# Altium project Tecotec_GYT_Tx.PrjPcb
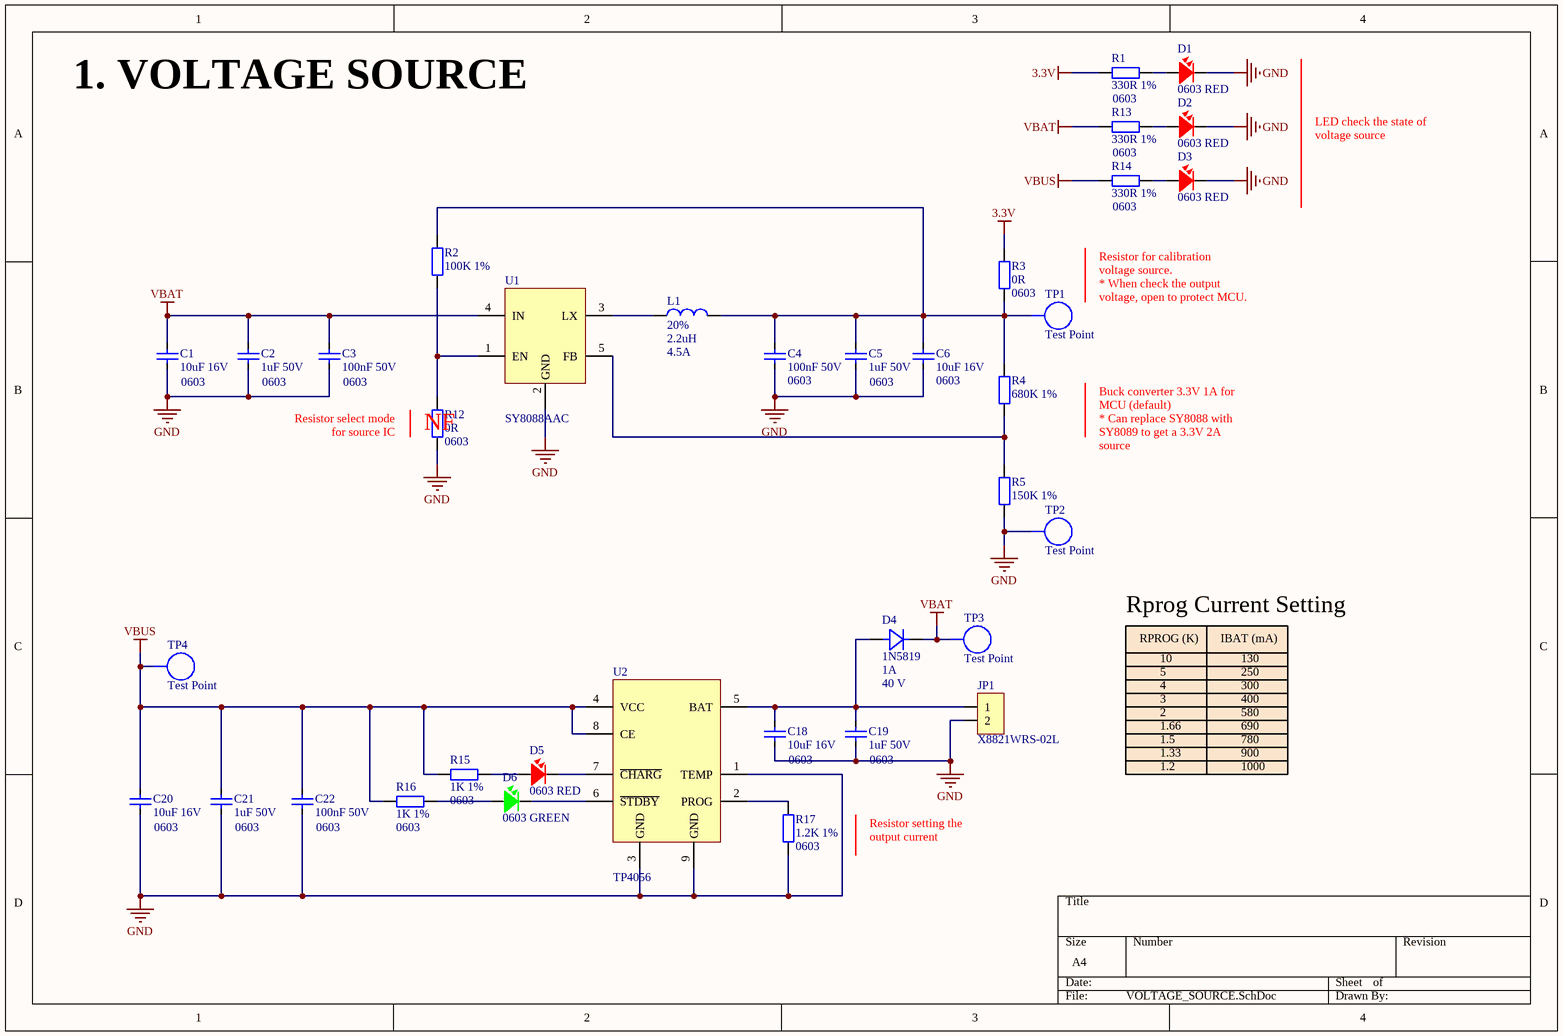
[diagram p0: VOLTAGE_SOURCE.SchDoc]
4 sheets, 103 parts. Net scope: global (net labels, ports and power ports of the same name join across sheets).
Board file: PCB.PcbDoc
Sheets:
  VOLTAGE_SOURCE.SchDoc
  DISPLAY.SchDoc
  MCU.SchDoc
  FUNCTION_BUTTONS.SchDoc

## Sheet VOLTAGE_SOURCE.SchDoc: Tecotec GYT Tx
size A4; DrawnBy: Nhatkhongbuon; SheetNumber: 1; SheetTotal: 4

### Parts
C1  10uF 16V  Size: 0603  [CAP_SMD_0603]
C2  1uF 50V  Size: 0603  [CAP_SMD_0603]
C3  100nF 50V  Size: 0603  [CAP_SMD_0603]
C4  100nF 50V  Size: 0603  [CAP_SMD_0603]
C5  1uF 50V  Size: 0603  [CAP_SMD_0603]
C6  10uF 16V  Size: 0603  [CAP_SMD_0603]
C18  10uF 16V  Size: 0603  [CAP_SMD_0603]
C19  1uF 50V  Size: 0603  [CAP_SMD_0603]
C20  10uF 16V  Size: 0603  [CAP_SMD_0603]
C21  1uF 50V  Size: 0603  [CAP_SMD_0603]
C22  100nF 50V  Size: 0603  [CAP_SMD_0603]
D1  0603 RED  [LED-0603]
D2  0603 RED  [LED-0603]
D3  0603 RED  [LED-0603]
D4  1N5819  Current - Average Rectified (Io): 1A  Voltage - DC Reverse (Vr) (Max): 40 V  [DIO-SMD-123]
D5  0603 RED  [LED-0603]
D6  0603 GREEN  [LED-0603]
JP1  X8821WRS-02L  [CONN_X8821WRS-02L-LPSN]
L1  Tolerance: 20%  Inductor: 2.2uH  Current: 4.5A  [L0420]  (hidden comment: 2.2uH 4.5A 20%)
R1  330R 1%  Size: 0603  [RES_SMD_0603]
R2  100K 1%  [RES_SMD_0603]
R3  0R  Size: 0603  [RES_SMD_0603]
R4  680K 1%  [RES_SMD_0603]
R5  150K 1%  [RES_SMD_0603]
R12  0R  Size: 0603  [RES_SMD_0603]
R13  330R 1%  Size: 0603  [RES_SMD_0603]
R14  330R 1%  Size: 0603  [RES_SMD_0603]
R15  1K 1%  Size: 0603  [RES_SMD_0603]
R16  1K 1%  Size: 0603  [RES_SMD_0603]
R17  1.2K 1%  Size: 0603  [RES_SMD_0603]
TP1  Test Point  [TEST_POINT]
TP2  Test Point  [TEST_POINT]
TP3  Test Point  [TEST_POINT]
TP4  Test Point  [TEST_POINT]
U1  SY8088AAC  [SOT23_5]
U2  TP4056  [ESOP-8]

### Nets
3.3V: R1.1 R3.2
GND: C1.1 C2.1 C3.1 C4.1 C5.1 C6.1 C18.1 C19.1 C20.1 C21.1 C22.1 D1.2 D2.2 D3.2 JP1.2 R5.1 R12.1 R17.1 TP2.1 U1.2(GND) U2.1(TEMP) U2.3(GND) U2.9(GND)
VBAT: C1.2 C2.2 C3.2 D4.C R13.1 TP3.1 U1.4(IN)
VBUS: C20.2 C21.2 C22.2 R14.1 R15.2 R16.2 TP4.1 U2.4(VCC) U2.8(CE)
NetC4_2: C4.2 C5.2 C6.2 L1.2 R2.2 R3.1 R4.2 TP1.1
NetC18_2: C18.2 C19.2 D4.A JP1.1 U2.5(BAT)
NetD1_1: D1.1 R1.2
NetD2_1: D2.1 R13.2
NetD3_1: D3.1 R14.2
NetD5_1: D5.1 R15.1
NetD5_2: D5.2 U2.7(~{CHARG})
NetD6_1: D6.1 R16.1
NetD6_2: D6.2 U2.6(~{STDBY})
NetL1_1: L1.1 U1.3(LX)
NetR2_1: R2.1 R12.2 U1.1(EN)
NetR4_1: R4.1 R5.2 U1.5(FB)
NetR17_2: R17.2 U2.2(PROG)

### Notes on the sheet
- 1. VOLTAGE SOURCE
- LED check the state of voltage source
- Resistor for calibration voltage source.
  * When check the output voltage, open to protect MCU.
- Resistor select mode for source IC
- (near R12) NF
- Buck converter 3.3V 1A for MCU (default)
  * Can replace SY8088 with SY8089 to get a 3.3V 2A source
- Rprog Current Setting
- RPROG (K)
- IBAT (mA)
- 10
- 2
- 3
- 4
- 5
- 130
- 250
- 300
- 400
- 580
- 1.66
- 1.5
- 1.33
- 1.2
- 690
- 780
- 900
- 1000
- Resistor setting the output current

### Library data of the parts
C1 C6 C18 C20 = C0603_MLCC_10uF_16V: 10 µF ±20% 16V Ceramic Capacitor X6S 0603 (1608 Metric); Manufacturer: Murata Electronics; Manufacture Part Number: GRM188C81C106MA73D; Packaging: Cut Tape (CT); Link: https://www.digikey.cn/en/products/detail/murata-electronics/GRM188C81C106MA73D/3900463; Price: $0.25
C2 C5 C19 C21 = C0603_MLCC_1uF_50V: 1 µF ±10% 50V Ceramic Capacitor X5R 0603 (1608 Metric); Manufacturer: Samsung Electro-Mechanics; Manufacture Part Number: CL10A105KB8NNNC; Packaging: Cut Tape (CT); Link: https://www.digikey.cn/en/products/detail/samsung-electro-mechanics/CL10A105KB8NNNC/3887518; Price: $0.14
C3 C4 C22 = C0603_MLCC_100nF_50V: 0.1 µF ±10% 50V Ceramic Capacitor X7R 0603 (1608 Metric); Manufacturer: Samsung Electro-Mechanics; Manufacture Part Number: CL10B104KB8NNNC; Packaging: Cut Tape (CT); Link: https://www.digikey.cn/en/products/detail/samsung-electro-mechanics/CL10B104KB8NNNC/3886658; Price: $0.10
D1-D3 D5 = LED_0603_RED: Red 625nm LED Indication - Discrete 2V 0603 (1608 Metric); Manufacturer: Würth Elektronik; Manufacture Part Number: 150060RS75000; Packaging: Cut Tape (CT); Link: https://www.digikey.cn/en/products/detail/w%C3%BCrth-elektronik/150060RS75000/4489901; Price: $0.15
D4 = 1N5819: Diode 40 V 1A Surface Mount SOD-123; Manufacturer: Diodes Incorporated; Manufacture Part Number: 1N5819HW-7-F; Voltage - Forward (Vf) (Max) @ If: 450 mV @ 1 A; Capacitance @ Vr, F: 60pF @ 4V, 1MHz; Packaging: Cut Tape (CT); Link: https://www.digikey.cn/en/products/detail/diodes-incorporated/1N5819HW-7-F/814970; Price: $0.43; Operating Temperature - Junction: -65°C ~ 125°C
D6 = LED_0603_GREEN: Green 520nm LED Indication - Discrete 3.2V 0603 (1608 Metric); Manufacturer: Würth Elektronik; Manufacture Part Number: 150060GS75000; Packaging: Cut Tape (CT); Link: https://www.digikey.cn/en/products/detail/w%C3%BCrth-elektronik/150060GS75000/4489898; Price: $0.15
JP1 = X8821WRS-02L: 1x2P 2P 1 Tin 2.5mm 2 Brass 2A Surface Mount，Right Angle SMD,P=2.5mm,Surface Mount，Right Angle Wire To Board Connector ROHS; Manufacturer: XKB Connection; Manufacture Part Number: X8821WRS-02L-LPSN; Link: https://www.lcsc.com/product-detail/Wire-To-Board-Connector_XKB-Connection-X8821WRS-02L-LPSN_C519150.html; Price: $ 0.0852
L1 = L_0420_2.2uH_4.5A: 4.5A 2.2uH Molding Choke ±20% 5A SMD,0420 Power Inductors ROHS; Manufacturer: XR; Manufacture Part Number: XR0420-2R2M; Link: https://www.lcsc.com/product-detail/Power-Inductors_XR-XR0420-2R2M_C5307589.html; Price: $ 0.0661
R1 R13 R14 = R0603_330R: 330 Ohms ±1% 0.1W, 1/10W Chip Resistor 0603 (1608 Metric) Thick Film; Manufacturer: TE Connectivity Passive Product; Manufacture Part Number: CRG0603F330R; Packaging: Cut Tape (CT); Link: https://www.digikey.cn/en/products/detail/te-connectivity-passive-product/CRG0603F330R/2380765; Price: $0.10
R2 = R0603_100K: 100 kOhms ±1% 0.1W, 1/10W Chip Resistor 0603 (1608 Metric) Moisture Resistant Thick Film; Manufacturer: YAGEO; Manufacture Part Number: RC0603FR-07100KL; Packaging: Cut Tape (CT); Link: https://www.digikey.cn/en/products/detail/yageo/RC0603FR-07100KL/726889; Price: $0.10; Size: 0603
R3 R12 = R0603_0R: 0 Ohms Jumper Chip Resistor 0603 (1608 Metric) Automotive AEC-Q200 Thick Film; Manufacturer: Stackpole Electronics Inc; Manufacture Part Number: RMCF0603ZT0R00; Packaging: Cut Tape (CT); Link: https://www.digikey.cn/en/products/detail/stackpole-electronics-inc/RMCF0603ZT0R00/1756908; Price: $0.10
R4 = R0603_680K: 680 kOhms ±1% 0.1W, 1/10W Chip Resistor 0603 (1608 Metric) Moisture Resistant Thick Film; Manufacturer: YAGEO; Manufacture Part Number: RC0603FR-07680KL; Packaging: Cut Tape (CT); Link: https://www.digikey.cn/en/products/detail/yageo/RC0603FR-07680KL/727356; Price: $0.10; Size: 0603
R5 = R0603_150K: 150 kOhms ±1% 0.1W, 1/10W Chip Resistor 0603 (1608 Metric) Automotive AEC-Q200 Thick Film; Manufacturer: Vishay Dale; Manufacture Part Number: CRCW0603150KFKEA; Packaging: Cut Tape (CT); Link: https://www.digikey.cn/en/products/detail/vishay-dale/CRCW0603150KFKEA/1174914; Price: $0.10; Size: 0603
R15 R16 = R0603_1K: 1 kOhms ±1% 0.1W, 1/10W Chip Resistor 0603 (1608 Metric) Moisture Resistant Thick Film; Manufacturer: YAGEO; Manufacture Part Number: RC0603FR-071KL; Packaging: Cut Tape (CT); Link: https://www.digikey.cn/en/products/detail/yageo/RC0603FR-071KL/726843; Price: $0.10
R17 = R0603_1.2K: 1.2 kOhms ±1% 0.1W, 1/10W Chip Resistor 0603 (1608 Metric) Automotive AEC-Q200 Thick Film; Manufacturer: Stackpole Electronics Inc; Manufacture Part Number: RC0603FR-071KL; Packaging: Cut Tape (CT); Link: https://www.digikey.cn/en/products/detail/stackpole-electronics-inc/RMCF0603FT1K20/1761134; Price: $0.10
TP1-TP4 = TEST_POINT
U1 = SY8088AAC: Step-down type SOT-23-5 DC-DC Converters ROHS; Manufacturer: Silergy Corp; Manufacture Part Number: SY8088AAC; Link: https://www.lcsc.com/product-detail/DC-DC-Converters_Silergy-Corp-SY8088AAC_C79313.html; Price: $ 0.0865
U2 = TP4056: ESOP-8 Battery Management ICs ROHS; Manufacturer: UMW(Youtai Semiconductor Co., Ltd.); Manufacture Part Number: TP4056; Packaging: Cut Tape (CT); Link: https://www.lcsc.com/product-detail/Battery-Management-ICs_UMW-Youtai-Semiconductor-Co-Ltd-TP4056_C725790.html; Price: $ 0.0565

## Sheet DISPLAY.SchDoc
size A4; SheetNumber: 2; SheetTotal: 4
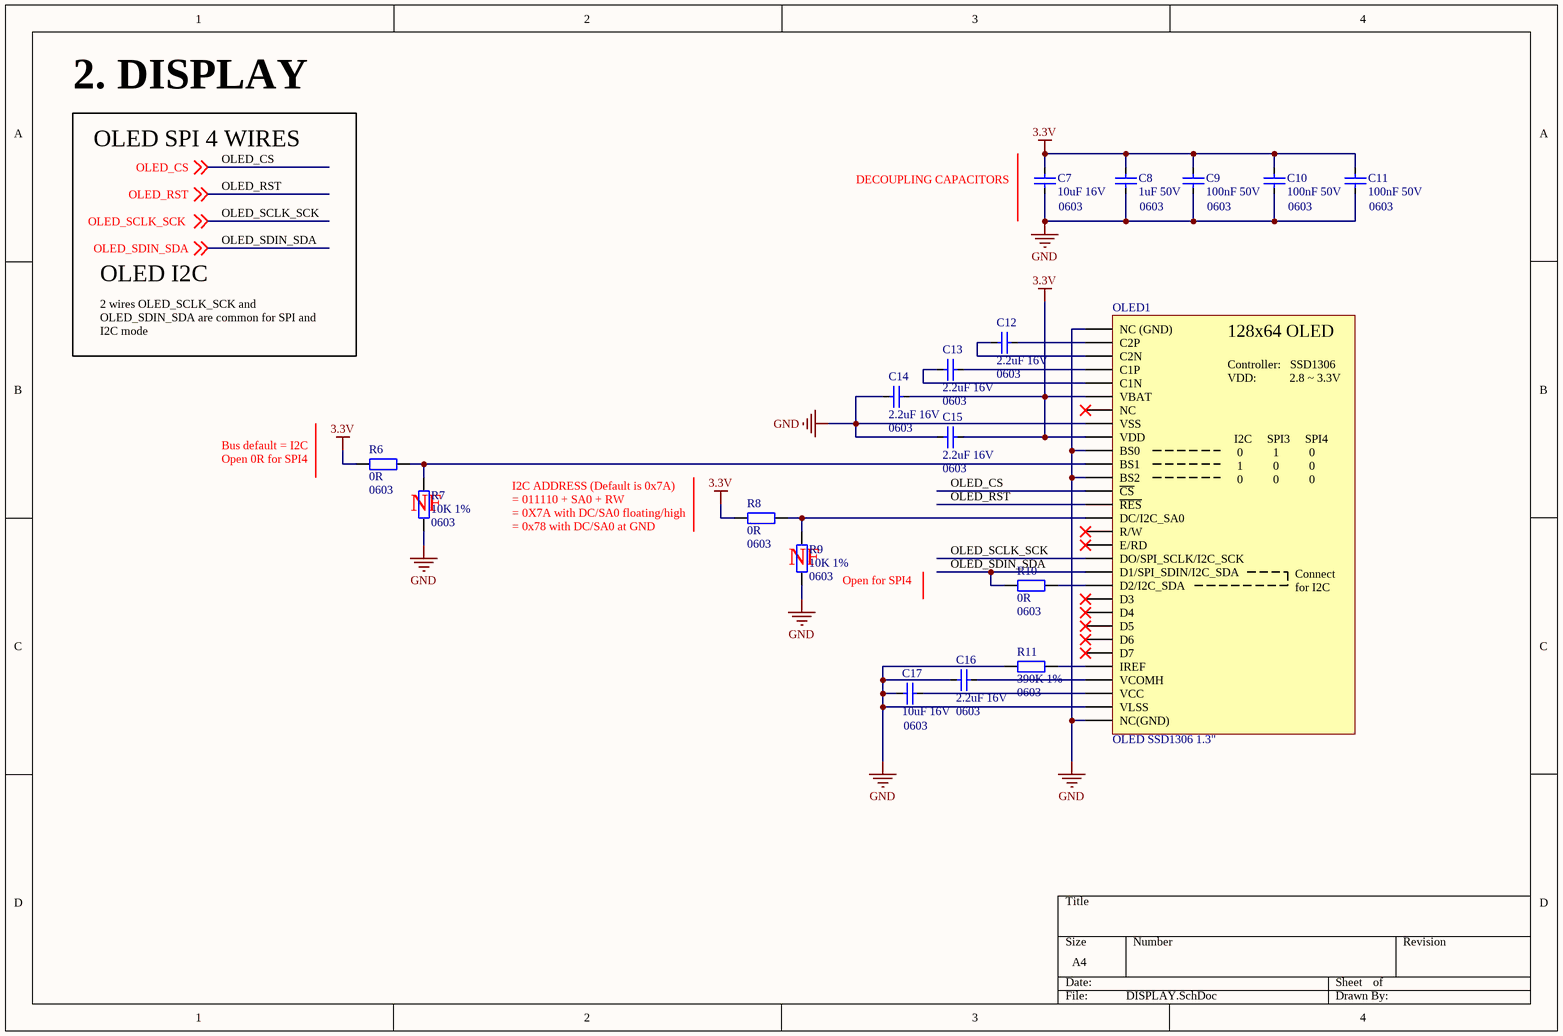
[diagram p1: DISPLAY.SchDoc]

### Parts
C7  10uF 16V  Size: 0603  [CAP_SMD_0603]
C8  1uF 50V  Size: 0603  [CAP_SMD_0603]
C9  100nF 50V  Size: 0603  [CAP_SMD_0603]
C10  100nF 50V  Size: 0603  [CAP_SMD_0603]
C11  100nF 50V  Size: 0603  [CAP_SMD_0603]
C12  2.2uF 16V  Size: 0603  [CAP_SMD_0603]
C13  2.2uF 16V  Size: 0603  [CAP_SMD_0603]
C14  2.2uF 16V  Size: 0603  [CAP_SMD_0603]
C15  2.2uF 16V  Size: 0603  [CAP_SMD_0603]
C16  2.2uF 16V  Size: 0603  [CAP_SMD_0603]
C17  10uF 16V  Size: 0603  [CAP_SMD_0603]
OLED1  OLED SSD1306 1.3"  [OLED 1.3]
R6  0R  Size: 0603  [RES_SMD_0603]
R7  10K 1%  Size: 0603  [RES_SMD_0603]
R8  0R  Size: 0603  [RES_SMD_0603]
R9  10K 1%  Size: 0603  [RES_SMD_0603]
R10  0R  Size: 0603  [RES_SMD_0603]
R11  390K 1%  Size: 0603  [RES_SMD_0603]

### Nets
3.3V: C7.2 C8.2 C9.2 C10.2 C11.2 C14.2 C15.2 OLED1.A6(VBAT) OLED1.A9(VDD) R6.1 R8.1
GND: C7.1 C8.1 C9.1 C10.1 C11.1 C14.1 C15.1 C16.2 C17.1 OLED1.A1(NC_(GND)) OLED1.A8(VSS) OLED1.A10(BS0) OLED1.A12(BS2) OLED1.A29(VLSS) OLED1.A30(NC(GND)) R7.1 R9.1 R11.1
OLED_CS: OLED1.A13(~{CS}) ; off-sheet OLED_CS
OLED_RST: OLED1.A14(~{RES}) ; off-sheet OLED_RST
OLED_SCLK_SCK: OLED1.A18(DO/SPI_SCLK/I2C_SCK) ; off-sheet OLED_SCLK_SCK   [also labelled OLED_SCLK_SCK ]
OLED_SDIN_SDA: OLED1.A19(D1/SPI_SDIN/I2C_SDA) R10.1 ; off-sheet OLED_SDIN_SDA  [also labelled OLED_SDIN_SDA ]
NetC12_1: C12.1 OLED1.A2(C2P)
NetC12_2: C12.2 OLED1.A3(C2N)
NetC13_1: C13.1 OLED1.A5(C1N)
NetC13_2: C13.2 OLED1.A4(C1P)
NetC16_1: C16.1 OLED1.A27(VCOMH)
NetC17_2: C17.2 OLED1.A28(VCC)
NetOLED1_A11: OLED1.A11(BS1) R6.2 R7.2
NetOLED1_A15: OLED1.A15(DC/I2C_SA0) R8.2 R9.2
NetOLED1_A20: OLED1.A20(D2/I2C_SDA) R10.2
NetOLED1_A26: OLED1.A26(IREF) R11.2

Not connected (* = marked no-connect by the designer): OLED1 A7(NC)* A16(R/W)* A17(E/RD)* A21(D3)* A22(D4)* A23(D5)* A24(D6)* A25(D7)*

### Notes on the sheet
- 2. DISPLAY
- OLED SPI 4 WIRES
- DECOUPLING CAPACITORS
- OLED I2C
- 2 wires OLED_SCLK_SCK and OLED_SDIN_SDA are common for SPI and I2C mode
- Bus default = I2C
  Open 0R for SPI4
- (near R7) NF
- (near R9) NF
- I2C ADDRESS (Default is 0x7A)
  = 011110 + SA0 + RW
  = 0X7A with DC/SA0 floating/high
  = 0x78 with DC/SA0 at GND
- (near R9) Open for SPI4
- (in symbol 1.3"_SSD1306_OLED) 128x64 OLED; Controller:   SSD1306 / VDD:           2.8 ~ 3.3V; I2C     SPI3     SPI4 / 0          1          0 / 1          0          0 / 0          0          0 /; Connect for I2C

### Library data of the parts
C7 C17 = C0603_MLCC_10uF_16V: as C1 on sheet VOLTAGE_SOURCE; Packaging: Cut Tape (CT); Link: https://www.digikey.cn/en/products/detail/murata-electronics/GRM188C81C106MA73D/3900463; Price: $0.25
C8 = C0603_MLCC_1uF_50V: as C2 on sheet VOLTAGE_SOURCE; Packaging: Cut Tape (CT); Link: https://www.digikey.cn/en/products/detail/samsung-electro-mechanics/CL10A105KB8NNNC/3887518; Price: $0.14
C9-C11 = C0603_MLCC_100nF_50V: as C3 on sheet VOLTAGE_SOURCE; Packaging: Cut Tape (CT); Link: https://www.digikey.cn/en/products/detail/samsung-electro-mechanics/CL10B104KB8NNNC/3886658; Price: $0.10
C12-C16 = C0603_MLCC_2.2uF_16V: 2.2 µF ±10% 16V Ceramic Capacitor X5R 0603 (1608 Metric); Manufacturer: Samsung Electro-Mechanics; Manufacture Part Number: CL10A225KO8NNNC; Packaging: Cut Tape (CT); Link: https://www.digikey.cn/en/products/detail/samsung-electro-mechanics/CL10A225KO8NNNC/3886698; Price: $0.10
OLED1 = 1.3"_SSD1306_OLED: SSD1306 1.3 - Organic Light Emitting Diode Display Screen ROHS; Manufacturer: UG(Univision Semicon); Manufacture Part Number: UG-2864KSWLG01; Link: https://www.lcsc.com/product-detail/Organic-Light-Emitting-Diode-Display-Screen_UG-Univision-Semicon-UG-2864KSWLG01_C113322.html; Price: $1.96; ComponentLink1Description: New link; ComponentLink1URL: *; Link 2: https://shopee.vn/M%C3%A0n-h%C3%ACnh-LCD-SUBEI-ssd1306-12864-B%E1%BA%A3ng-m%C3%A0n-h%C3%ACnh-LCD-LCD-m%C3%B4-%C4%91un-m%C3%A0n-h%C3%ACnh-LCD-OLED-1-3-inch-12864-OLED-30PIN-c%C3%B3-th%E1%BB%83-s%E1%BB%AD-d%E1%BB%A5ng-i.293689495.25025709755?sp_atk=b5fb3fe1-8310-4ca9-bbd1-9b1802fa8d8a&xptdk=b5fb3fe1-8310-4ca9-bbd1-9b1802fa8d8a
R6 R8 R10 = R0603_0R: as R3 on sheet VOLTAGE_SOURCE; Packaging: Cut Tape (CT); Link: https://www.digikey.cn/en/products/detail/stackpole-electronics-inc/RMCF0603ZT0R00/1756908; Price: $0.10
R7 R9 = R0603_10K: 10 kOhms ±1% 0.1W, 1/10W Chip Resistor 0603 (1608 Metric) Moisture Resistant Thick Film; Manufacturer: YAGEO; Manufacture Part Number: RC0603FR-0710KL; Packaging: Cut Tape (CT); Link: https://www.digikey.cn/en/products/detail/yageo/RC0603FR-0710KL/726880; Price: $0.10
R11 = R0603_390K: 390 kOhms ±1% 0.1W, 1/10W Chip Resistor 0603 (1608 Metric) Moisture Resistant Thick Film; Manufacturer: YAGEO; Manufacture Part Number: RC0603FR-07390KL; Packaging: Cut Tape (CT); Link: https://www.digikey.cn/en/products/detail/yageo/RC0603FR-07390KL/727199; Price: $0.10

## Sheet MCU.SchDoc
size A4; SheetNumber: 3; SheetTotal: 4
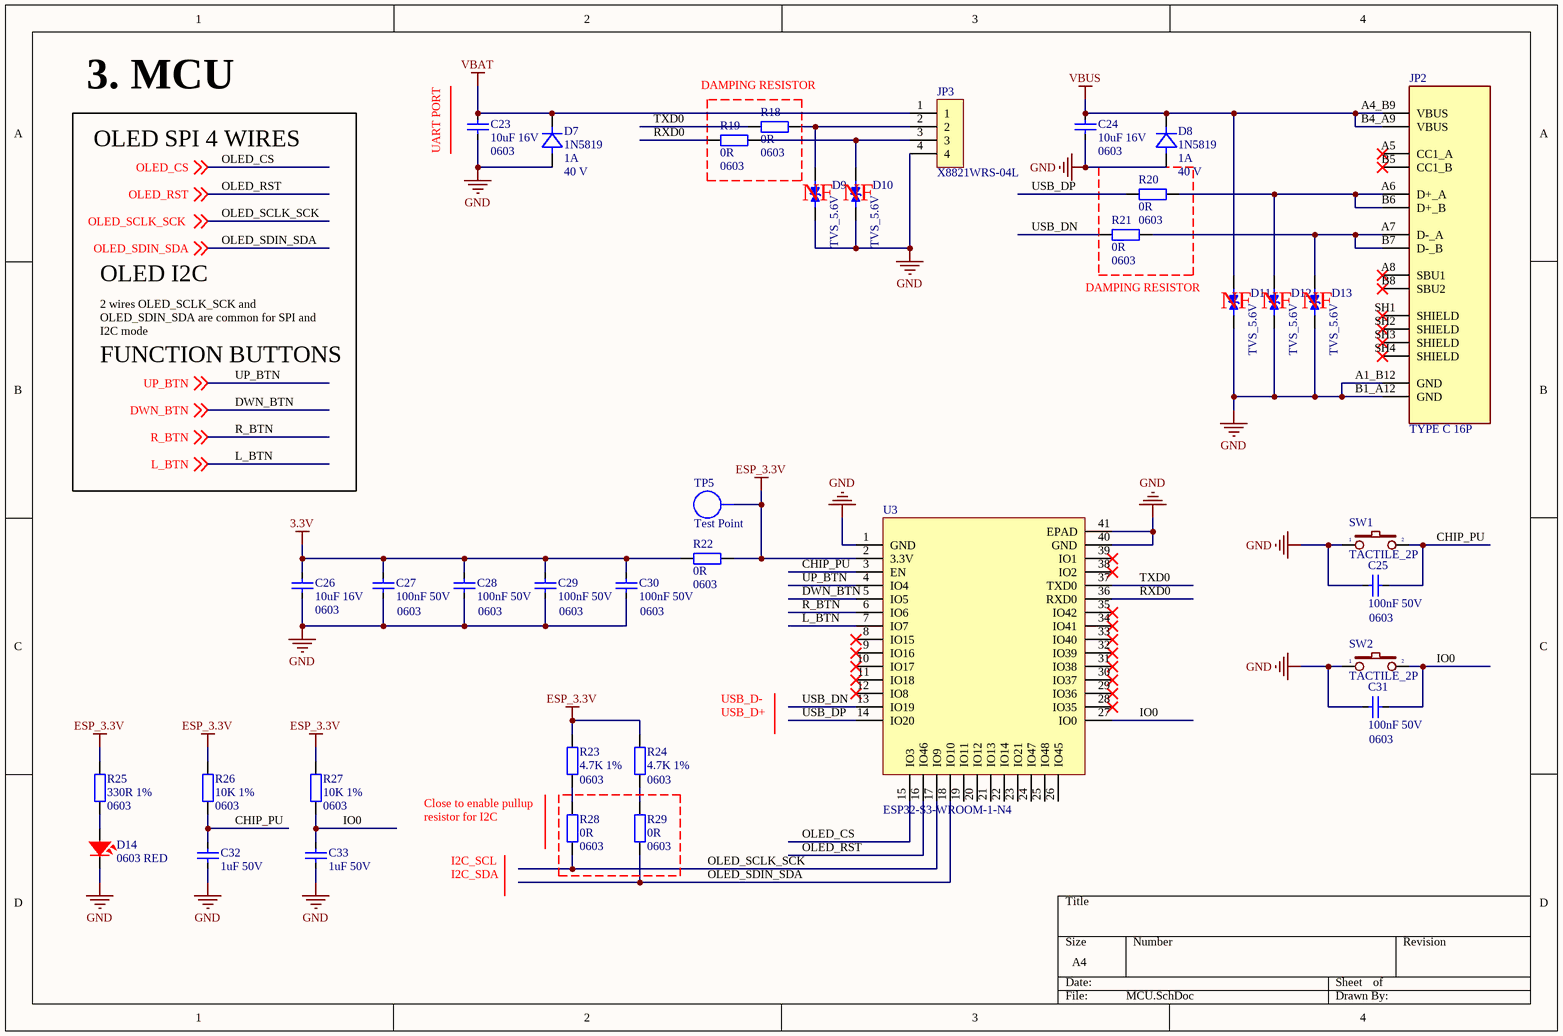
[diagram p2: MCU.SchDoc]

### Parts
C23  10uF 16V  Size: 0603  [CAP_SMD_0603]
C24  10uF 16V  Size: 0603  [CAP_SMD_0603]
C25  100nF 50V  Size: 0603  [CAP_SMD_0603]
C26  10uF 16V  Size: 0603  [CAP_SMD_0603]
C27  100nF 50V  Size: 0603  [CAP_SMD_0603]
C28  100nF 50V  Size: 0603  [CAP_SMD_0603]
C29  100nF 50V  Size: 0603  [CAP_SMD_0603]
C30  100nF 50V  Size: 0603  [CAP_SMD_0603]
C31  100nF 50V  Size: 0603  [CAP_SMD_0603]
C32  1uF 50V  [CAP_SMD_0603]
C33  1uF 50V  [CAP_SMD_0603]
D7  1N5819  Current - Average Rectified (Io): 1A  Voltage - DC Reverse (Vr) (Max): 40 V  [DIO-SMD-123]
D8  1N5819  Current - Average Rectified (Io): 1A  Voltage - DC Reverse (Vr) (Max): 40 V  [DIO-SMD-123]
D9  TVS_5.6V  [SOD_523]
D10  TVS_5.6V  [SOD_523]
D11  TVS_5.6V  [SOD_523]
D12  TVS_5.6V  [SOD_523]
D13  TVS_5.6V  [SOD_523]
D14  0603 RED  [LED-0603]
JP2  TYPE C 16P  [TYPE C 16P]
JP3  X8821WRS-04L  [CONN_X8821WRS-04L-LPSN]
R18  0R  Size: 0603  [RES_SMD_0603]
R19  0R  Size: 0603  [RES_SMD_0603]
R20  0R  Size: 0603  [RES_SMD_0603]
R21  0R  Size: 0603  [RES_SMD_0603]
R22  0R  Size: 0603  [RES_SMD_0603]
R23  4.7K 1%  Size: 0603  [RES_SMD_0603]
R24  4.7K 1%  Size: 0603  [RES_SMD_0603]
R25  330R 1%  Size: 0603  [RES_SMD_0603]
R26  10K 1%  Size: 0603  [RES_SMD_0603]
R27  10K 1%  Size: 0603  [RES_SMD_0603]
R28  0R  Size: 0603  [RES_SMD_0603]
R29  0R  Size: 0603  [RES_SMD_0603]
SW1  TACTILE_2P  [C&K SW 2P]
SW2  TACTILE_2P  [C&K SW 2P]
TP5  Test Point  [TEST_POINT]
U3  ESP32-S3-WROOM-1-N4  [ESP32-S3-WROOM-1]

### Nets
3.3V: C26.1 C27.2 C28.2 C29.2 C30.2 R22.2
ESP_3.3V: R22.1 R23.2 R24.2 R25.1 R26.2 R27.2 TP5.1 U3.2(3.3V)
GND: C23.2 C24.2 C25.1 C26.2 C27.1 C28.1 C29.1 C30.1 C31.1 C32.1 C33.1 D7.A D8.A D9.1 D10.1 D11.1 D12.1 D13.1 D14.2 JP2.A1_B12(GND) JP2.B1_A12(GND) JP3.4 SW1.1 SW2.1 U3.1(GND) U3.40(GND) U3.41(EPAD)
VBAT: C23.1 D7.C JP3.1
VBUS: C24.1 D8.C D11.2 JP2.A4_B9(VBUS) JP2.B4_A9(VBUS)
CHIP_PU: C25.2 C32.2 R26.1 SW1.2 U3.3(EN)
DWN_BTN: U3.5(IO5) ; off-sheet DWN_BTN
IO0: C31.2 C33.2 R27.1 SW2.2 U3.27(IO0)
L_BTN: U3.7(IO7) ; off-sheet L_BTN
OLED_CS: U3.15(IO3) ; off-sheet OLED_CS
OLED_RST: U3.16(IO46) ; off-sheet OLED_RST
OLED_SCLK_SCK: R28.2 U3.17(IO9) ; off-sheet OLED_SCLK_SCK   [also labelled OLED_SCLK_SCK ]
OLED_SDIN_SDA: R29.2 U3.18(IO10) ; off-sheet OLED_SDIN_SDA  [also labelled OLED_SDIN_SDA ]
R_BTN: U3.6(IO6) ; off-sheet R_BTN
RXD0: R19.2 U3.36(RXD0)
TXD0: R18.2 U3.37(TXD0)
UP_BTN: U3.4(IO4) ; off-sheet UP_BTN
USB_DN: R21.2 U3.13(IO19)
USB_DP: R20.2 U3.14(IO20)
NetD9_2: D9.2 JP3.2 R18.1
NetD10_2: D10.2 JP3.3 R19.1
NetD12_2: D12.2 JP2.A6(D+_A) JP2.B6(D+_B) R20.1
NetD13_2: D13.2 JP2.A7(D-_A) JP2.B7(D-_B) R21.1
NetD14_1: D14.1 R25.2
NetR23_1: R23.1 R28.1
NetR24_1: R24.1 R29.1

Not connected (* = marked no-connect by the designer): JP2 A5(CC1_A)* A8(SBU1)* B5(CC1_B)* B8(SBU2)* SH1(SHIELD)* SH2(SHIELD)* SH3(SHIELD)* SH4(SHIELD)*; U3 8(IO15)* 9(IO16)* 10(IO17)* 11(IO18)* 12(IO8)* 19(IO11) 20(IO12) 21(IO13) 22(IO14) 23(IO21) 24(IO47) 25(IO48) 26(IO45) 28(IO35)* 29(IO36)* 30(IO37)* 31(IO38)* 32(IO39)* 33(IO40)* 34(IO41)* 35(IO42)* 38(IO2)* 39(IO1)*

### Notes on the sheet
- 3. MCU
- DAMPING RESISTOR
- OLED SPI 4 WIRES
- (near C23) UART PORT
- (near D9) NF
- (near D10) NF
- OLED I2C
- (near D11) NF
- (near D12) NF
- (near D13) NF
- 2 wires OLED_SCLK_SCK and OLED_SDIN_SDA are common for SPI and I2C mode
- FUNCTION BUTTONS
- USB_D-
- USB_D+
- Close to enable pullup resistor for I2C
- I2C_SCL
- I2C_SDA

### Library data of the parts
C23 C24 C26 = C0603_MLCC_10uF_16V: as C1 on sheet VOLTAGE_SOURCE; Packaging: Cut Tape (CT); Link: https://www.digikey.cn/en/products/detail/murata-electronics/GRM188C81C106MA73D/3900463; Price: $0.25
C25 C27-C31 = C0603_MLCC_100nF_50V: as C3 on sheet VOLTAGE_SOURCE; Packaging: Cut Tape (CT); Link: https://www.digikey.cn/en/products/detail/samsung-electro-mechanics/CL10B104KB8NNNC/3886658; Price: $0.10
C32 C33 = C0603_MLCC_1uF_50V: as C2 on sheet VOLTAGE_SOURCE; Packaging: Cut Tape (CT); Link: https://www.digikey.cn/en/products/detail/samsung-electro-mechanics/CL10A105KB8NNNC/3887518; Price: $0.14; Size: 0603
D7 D8 = 1N5819: as D4 on sheet VOLTAGE_SOURCE; Packaging: Cut Tape (CT); Link: https://www.digikey.cn/en/products/detail/diodes-incorporated/1N5819HW-7-F/814970; Price: $0.43; Operating Temperature - Junction: -65°C ~ 125°C
D9-D13 = TVS_5.6V: 9.4A 18.6V 5.6V Bi-Directional 5V SOD-523 Electrostatic and Surge Protection (TVS/ESD) ROHS; Manufacturer: LRC; Manufacture Part Number: LESD5D5.0CT1G; Voltage - Reverse Standoff (Typ): 4V; Voltage - Breakdown (Min): 6V; Voltage - Clamping (Max) @ Ipp: 8V; Packaging: Cut Tape (CT); Link: https://www.lcsc.com/product-detail/New-Arrivals_Leshan-Radio-LESD5D5-0CT1G_C383211.html; Price: $ 0.0149
D14 = LED_0603_RED: as D1 on sheet VOLTAGE_SOURCE; Packaging: Cut Tape (CT); Link: https://www.digikey.cn/en/products/detail/w%C3%BCrth-elektronik/150060RS75000/4489901; Price: $0.15
JP2 = TYPE_C_16P: USB-C (USB TYPE-C) USB 2.0 Receptacle Connector 24 (16+8 Dummy) Position Surface Mount, Right Angle; Through Hole; Manufacturer: Amphenol ICC (Commercial Products); Manufacture Part Number: 12402012E212A; Packaging: Cut Tape; Link: https://www.digikey.cn/en/products/detail/amphenol-cs-commercial-products/12402012E212A/13683192; Price: $0.79
JP3 = X8821WRS-04L: 1x4P 4P XH 1 Tin 2.5mm 4 3A Brass Surface Mount，Right Angle SMD,P=2.5mm,Surface Mount，Right Angle Wire To Board Connector ROHS; Manufacturer: XKB Connection; Manufacture Part Number: X8821WRS-04-9TSN; Link: https://www.lcsc.com/product-detail/Wire-To-Board-Connector_XKB-Connection-X8821WRS-04-9TSN_C397434.html; Price: $ 0.1564
R18-R22 R28 R29 = R0603_0R: as R3 on sheet VOLTAGE_SOURCE; Packaging: Cut Tape (CT); Link: https://www.digikey.cn/en/products/detail/stackpole-electronics-inc/RMCF0603ZT0R00/1756908; Price: $0.10
R23 R24 = R0603_4.7K: 4.7 kOhms ±1% 0.1W, 1/10W Chip Resistor 0603 (1608 Metric) Moisture Resistant Thick Film; Manufacturer: YAGEO; Manufacture Part Number: RC0603FR-074K7L; Packaging: Cut Tape (CT); Link: https://www.digikey.com/en/products/detail/yageo/RC0603FR-074K7L/727212; Price: $0.10
R25 = R0603_330R: as R1 on sheet VOLTAGE_SOURCE; Packaging: Cut Tape (CT); Link: https://www.digikey.cn/en/products/detail/te-connectivity-passive-product/CRG0603F330R/2380765; Price: $0.10
R26 R27 = R0603_10K: as R7 on sheet DISPLAY; Packaging: Cut Tape (CT); Link: https://www.digikey.cn/en/products/detail/yageo/RC0603FR-0710KL/726880; Price: $0.10
SW1 SW2 = SWITCH_TACTILE_SPST: Tactile Switch SPST-NO Top Actuated Surface Mount; Manufacturer: C&K; Manufacture Part Number: PTS636 SM25F SMTR LFS; Packaging: Cut Tape (CT); Link: https://www.digikey.cn/en/products/detail/c-k/PTS636-SM25F-SMTR-LFS/10071742?s=N4IgTCBcDaIAoBUDKA2AzCgBEgsmArAGLY4IBKmAMoUiALoC%2BQA; Price: $0.24
TP5 = TEST_POINT
U3 = ESP32-S3-WROOM-1-N4: SMD,18x25.5mm WiFi Modules ROHS; Manufacturer: Espressif Systems; Manufacture Part Number: ESP32-S3-WROOM-1-N4; Packaging: Cut Tape (CT); Link: https://www.lcsc.com/product-detail/WiFi-Modules_Espressif-Systems-ESP32-S3-WROOM-1-N4_C2913197.html; Price: $ 3.71

## Sheet FUNCTION_BUTTONS.SchDoc
size A; SheetNumber: 4; SheetTotal: 4
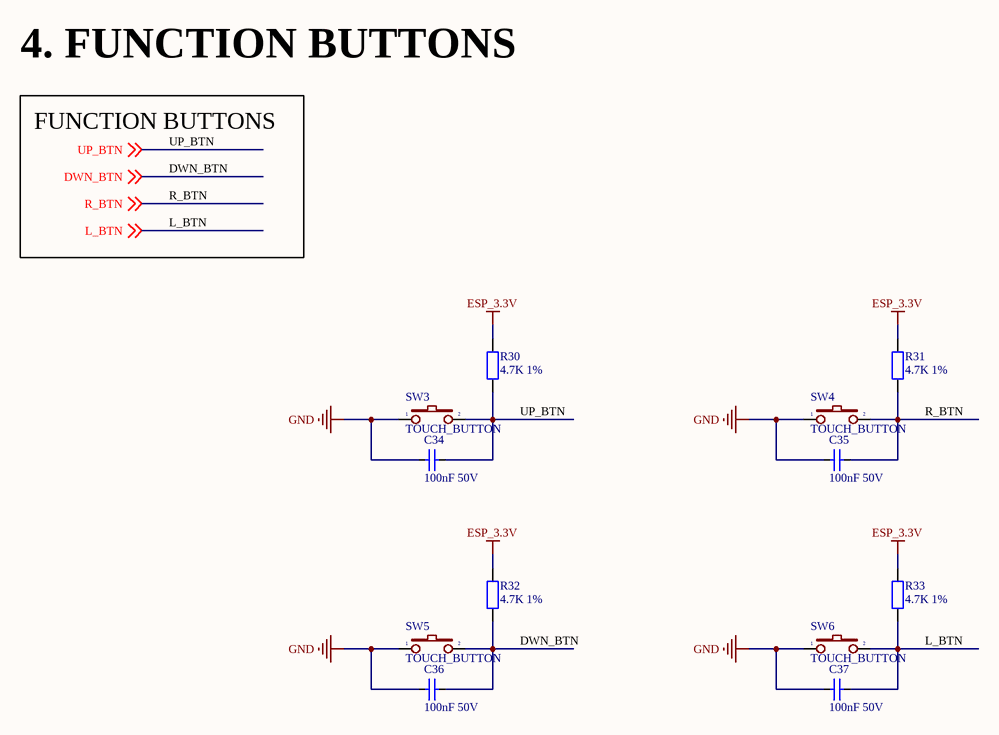
[diagram p3: FUNCTION_BUTTONS.SchDoc]

### Parts
C34  100nF 50V  [CAP_SMD_0603]
C35  100nF 50V  [CAP_SMD_0603]
C36  100nF 50V  [CAP_SMD_0603]
C37  100nF 50V  [CAP_SMD_0603]
R30  4.7K 1%  [RES_SMD_0603]
R31  4.7K 1%  [RES_SMD_0603]
R32  4.7K 1%  [RES_SMD_0603]
R33  4.7K 1%  [RES_SMD_0603]
SW3  TOUCH_BUTTON  [TOUCH_BUTTON]
SW4  TOUCH_BUTTON  [TOUCH_BUTTON]
SW5  TOUCH_BUTTON  [TOUCH_BUTTON]
SW6  TOUCH_BUTTON  [TOUCH_BUTTON]

### Nets
ESP_3.3V: R30.2 R31.2 R32.2 R33.2
GND: C34.1 C35.1 C36.1 C37.1 SW3.1 SW4.1 SW5.1 SW6.1
DWN_BTN: C36.2 R32.1 SW5.2 ; off-sheet DWN_BTN
L_BTN: C37.2 R33.1 SW6.2 ; off-sheet L_BTN
R_BTN: C35.2 R31.1 SW4.2 ; off-sheet R_BTN
UP_BTN: C34.2 R30.1 SW3.2 ; off-sheet UP_BTN

### Notes on the sheet
- 4. FUNCTION BUTTONS
- FUNCTION BUTTONS

### Library data of the parts
C34-C37 = C0603_MLCC_100nF_50V: as C3 on sheet VOLTAGE_SOURCE; Packaging: Cut Tape (CT); Link: https://www.digikey.cn/en/products/detail/samsung-electro-mechanics/CL10B104KB8NNNC/3886658; Price: $0.10; Size: 0603
R30-R33 = R0603_4.7K: as R23 on sheet MCU; Packaging: Cut Tape (CT); Link: https://www.digikey.com/en/products/detail/yageo/RC0603FR-074K7L/727212; Price: $0.10; Size: 0603

## Nets that join several sheets
3.3V: VOLTAGE_SOURCE (R1.1 R3.2), DISPLAY (11 pins), MCU (6 pins)
ESP_3.3V: MCU (8 pins), FUNCTION_BUTTONS (R30.2 R31.2 R32.2 R33.2)
GND: VOLTAGE_SOURCE (23 pins), DISPLAY (18 pins), MCU (27 pins), FUNCTION_BUTTONS (8 pins)
VBAT: VOLTAGE_SOURCE (7 pins), MCU (C23.1 D7.C JP3.1)
VBUS: VOLTAGE_SOURCE (9 pins), MCU (5 pins)
DWN_BTN: MCU (U3.5), FUNCTION_BUTTONS (C36.2 R32.1 SW5.2)
L_BTN: MCU (U3.7), FUNCTION_BUTTONS (C37.2 R33.1 SW6.2)
OLED_CS: DISPLAY (OLED1.A13), MCU (U3.15)
OLED_RST: DISPLAY (OLED1.A14), MCU (U3.16)
OLED_SCLK_SCK: DISPLAY (OLED1.A18), MCU (R28.2 U3.17)
OLED_SDIN_SDA: DISPLAY (OLED1.A19 R10.1), MCU (R29.2 U3.18)
R_BTN: MCU (U3.6), FUNCTION_BUTTONS (C35.2 R31.1 SW4.2)
UP_BTN: MCU (U3.4), FUNCTION_BUTTONS (C34.2 R30.1 SW3.2)